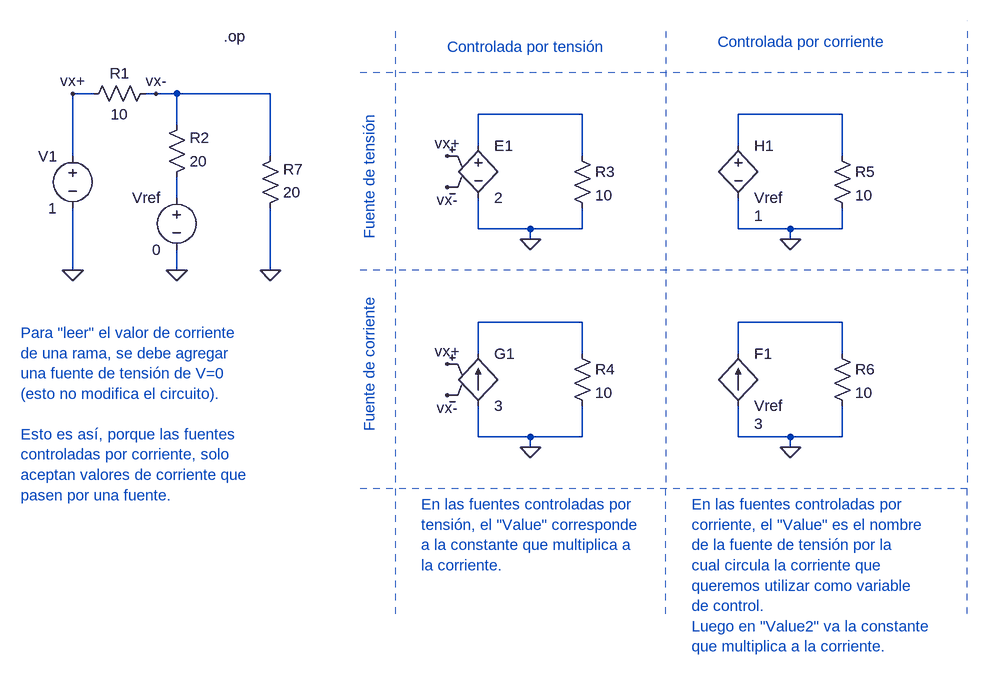
[diagram p0: schematic fuentes_controladas.asc]
fuentes_controladas.asc, the LTspice schematic file:
Version 4
SHEET 1 1060 812
WIRE -288 -32 -320 -32
WIRE -192 -32 -208 -32
WIRE -160 -32 -192 -32
WIRE -16 -32 -160 -32
WIRE 464 0 304 0
WIRE 864 0 704 0
WIRE -160 16 -160 -32
WIRE 304 48 304 0
WIRE 704 48 704 0
WIRE -320 64 -320 -32
WIRE -16 64 -16 -32
WIRE 464 64 464 0
WIRE 864 64 864 0
WIRE -160 128 -160 96
WIRE 304 176 304 128
WIRE 384 176 304 176
WIRE 464 176 464 144
WIRE 464 176 384 176
WIRE 704 176 704 128
WIRE 784 176 704 176
WIRE 864 176 864 144
WIRE 864 176 784 176
WIRE 384 192 384 176
WIRE 784 192 784 176
WIRE -320 240 -320 144
WIRE -160 240 -160 208
WIRE -16 240 -16 144
WIRE 464 320 304 320
WIRE 864 320 704 320
WIRE 304 368 304 320
WIRE 464 368 464 320
WIRE 704 368 704 320
WIRE 864 368 864 320
WIRE 304 496 304 448
WIRE 384 496 304 496
WIRE 464 496 464 448
WIRE 464 496 384 496
WIRE 704 496 704 448
WIRE 784 496 704 496
WIRE 864 496 864 448
WIRE 864 496 784 496
WIRE 384 512 384 496
WIRE 784 512 784 496
FLAG 256 64 vx+
FLAG 256 112 vx-
FLAG -320 240 0
FLAG -160 240 0
FLAG -320 -32 vx+
FLAG -192 -32 vx-
FLAG 384 192 0
FLAG 384 512 0
FLAG 256 384 vx+
FLAG 256 432 vx-
FLAG 784 192 0
FLAG 784 512 0
FLAG -16 240 0
DATAFLAG 768 0 ""
DATAFLAG 384 0 ""
DATAFLAG 784 320 ""
DATAFLAG 960 352 "I(R6)"
DATAFLAG 384 320 ""
DATAFLAG 960 48 "I(R5)"
DATAFLAG 512 48 "I(R3)"
DATAFLAG 512 352 "I(R4)"
DATAFLAG -256 -112 "V(vx+)-V(Vx-)"
DATAFLAG -96 224 "I(Vref)"
SYMBOL e 304 32 R0
SYMATTR InstName E1
SYMATTR Value 2
SYMBOL res 448 48 R0
SYMATTR InstName R3
SYMATTR Value 10
SYMBOL voltage -320 48 M0
WINDOW 123 0 0 Left 0
WINDOW 39 0 0 Left 0
SYMATTR InstName V1
SYMATTR Value 1
SYMBOL res -192 -48 R90
WINDOW 0 0 56 VBottom 2
WINDOW 3 32 56 VTop 2
SYMATTR InstName R1
SYMATTR Value 10
SYMBOL res -176 112 M180
WINDOW 0 36 76 Left 2
WINDOW 3 36 40 Left 2
SYMATTR InstName R2
SYMATTR Value 20
SYMBOL g 304 352 R0
SYMATTR InstName G1
SYMATTR Value 3
SYMBOL res 448 352 R0
SYMATTR InstName R4
SYMATTR Value 10
SYMBOL res 848 48 R0
SYMATTR InstName R5
SYMATTR Value 10
SYMBOL res 848 352 R0
SYMATTR InstName R6
SYMATTR Value 10
SYMBOL f 704 448 M180
WINDOW 0 24 80 Left 2
WINDOW 3 24 0 Left 2
WINDOW 123 24 -28 Left 2
SYMATTR InstName F1
SYMATTR Value Vref
SYMATTR Value2 3
SYMBOL h 704 32 R0
WINDOW 123 24 124 Left 2
SYMATTR Value2 1
SYMATTR InstName H1
SYMATTR Value Vref
SYMBOL voltage -160 112 M0
WINDOW 123 0 0 Left 0
WINDOW 39 0 0 Left 0
SYMATTR InstName Vref
SYMATTR Value 0
SYMBOL res -32 160 M180
WINDOW 0 36 76 Left 2
WINDOW 3 36 40 Left 2
SYMATTR InstName R7
SYMATTR Value 20
TEXT -88 -120 Left 2 !.op
TEXT 256 -104 Left 2 ;Controlada por tensión
TEXT 672 -112 Left 2 ;Controlada por corriente
TEXT 136 192 VLeft 2 ;Fuente de tensión
TEXT 136 488 VLeft 2 ;Fuente de corriente
TEXT -400 336 Left 2 ;Para "leer" el valor de corriente\nde una rama, se debe agregar\nuna fuente de tensión de V=0\n(esto no modifica el circuito).\n \nEsto es así, porque las fuentes\ncontroladas por corriente, solo\naceptan valores de corriente que\npasen por una fuente.
TEXT 216 600 Left 2 ;En las fuentes controladas por\ntensión, el "Value" corresponde\na la constante que multiplica a\nla corriente.
TEXT 632 600 Left 2 ;En las fuentes controladas por\ncorriente, el "Value" es el nombre\nde la fuente de tensión por la\ncual circula la corriente que\nqueremos utilizar como variable\nde control.\nLuego en "Value2" va la constante\nque multiplica a la corriente.
LINE Normal 592 -128 592 576 2
LINE Normal 1056 240 112 240 2
LINE Normal 1056 -144 1056 -144 2
LINE Normal 1056 -144 1056 -144 2
LINE Normal 1056 -144 1056 -144 2
LINE Normal 1056 576 112 576 2
LINE Normal 1056 -128 1056 576 2
LINE Normal 176 -128 176 576 2
LINE Normal 1056 -64 112 -64 2
LINE Normal 176 576 176 768 2
LINE Normal 592 768 592 576 2
LINE Normal 1056 768 1056 576 2

The netlist it stands for:
* fuentes_controladas.asc
E1 N001 0 vx+ vx- 2
R3 N001 0 10
V1 vx+ 0 1
R1 vx- vx+ 10
R2 N003 vx- 20
G1 0 N004 vx+ vx- 3
R4 N004 0 10
R5 N002 0 10
R6 N005 0 10
F1 0 N005 Vref 3
H1 N002 0 Vref 1
Vref N003 0 0
R7 0 vx- 20
.op
* Controlada por tensión
* Controlada por corriente
* Fuente de tensión
* Fuente de corriente
* Para "leer" el valor de corriente
* de una rama, se debe agregar
* una fuente de tensión de V=0
* (esto no modifica el circuito).
* Esto es así, porque las fuentes
* controladas por corriente, solo
* aceptan valores de corriente que
* pasen por una fuente.
* En las fuentes controladas por
* tensión, el "Value" corresponde
* a la constante que multiplica a
* la corriente.
* En las fuentes controladas por
* corriente, el "Value" es el nombre
* de la fuente de tensión por la
* cual circula la corriente que
* queremos utilizar como variable
* de control.
* Luego en "Value2" va la constante
* que multiplica a la corriente.
.backanno
.end